# EAGLE design laser (EAGLE 9.6.2)
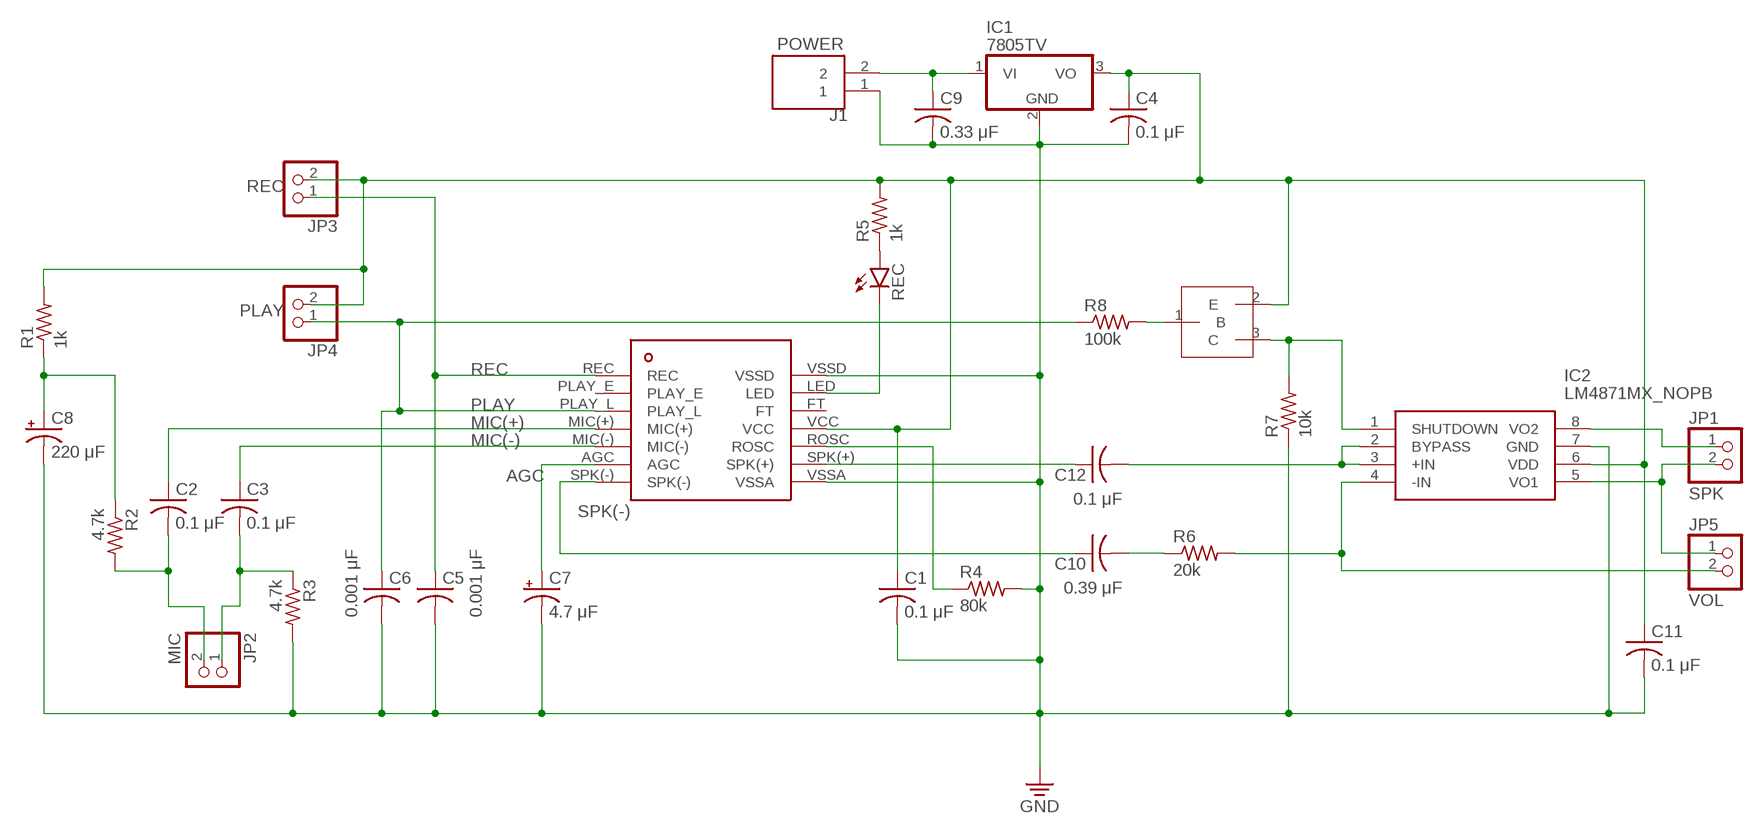
[diagram p0: schematic, sheet 1]

## Parts
C1  0.1 μF  C-USC0805  [C0805]
C2  0.1 μF  C-USC0805  [C0805]
C3  0.1 μF  C-USC0805  [C0805]
C4  0.1 μF  C-USC0805  [C0805]
C5  0.001 μF  C-USC0805  [C0805]
C6  0.001 μF  C-USC0805  [C0805]
C7  4.7 μF  C-POL-US_RADIAL-11MM-DIA  [CAPPRD508W65D1000H1100B]
C8  220 μF  C-POL-US_RADIAL-11MM-DIA  [CAPPRD508W65D1000H1100B]
C9  0.33 μF  C-USC0805  [C0805]
C10  0.39 μF  C-USC0805  [C0805]
C11  0.1 μF  C-USC0805  [C0805]
C12  0.1 μF  C-USC0805  [C0805]
IC1  7805TV  [TO220V]
IC2  LM4871MX_NOPB  [SOIC127P600X175-8N]
J1  POWER  TB004-508-02BE  [CUI_TB004-508-02BE]
JP1  SPK  PINHD-1X2  [1X02]
JP2  MIC  PINHD-1X2  [1X02]
JP3  REC  PINHD-1X2  [1X02]
JP4  PLAY  PINHD-1X2  [1X02]
JP5  VOL  PINHD-1X2  [1X02]
R1  1k  R-US_R0805  [R0805]
R2  4.7k  R-US_R0805  [R0805]
R3  4.7k  R-US_R0805  [R0805]
R4  80k  R-US_R0805  [R0805]
R5  1k  R-US_R0805  [R0805]
R6  20k  R-US_R0805  [R0805]
R7  10k  R-US_R0805  [R0805]
R8  100k  R-US_R0805  [R0805]
REC  LEDCHIP-LED0805  [CHIP-LED0805]
U$1  ISD1820PY  [ISD1820PY]
U$2  2PB709ARL,235  [SOT95P230X110-3N]

## Nets
+5V: C1.1 C4.1 C11.1 IC1.3(VO) IC2.6(VDD) JP3.2 JP4.2 R1.2 R5.2 U$1.VCC U$2.2(E)
AGC: C7.1(+) U$1.AGC
COLLECTOR: IC2.1(SHUTDOWN) R7.2 U$2.3(C)
GND: C1.2 C4.2 C5.2 C6.2 C7.2(-) C8.2(-) C9.2 C11.2 IC1.2(GND) IC2.7(GND) J1.1 R3.2 R4.2 R7.1 U$1.VSSA U$1.VSSD
MIC(+): C2.1 U$1.MIC(+)
MIC(-): C3.1 U$1.MIC(-)
N$1: IC2.8(VO2) JP1.1
N$2: IC2.5(VO1) JP1.2 JP5.1
N$3: R8.2 U$2.1(B)
N$4: IC2.4(-IN) JP5.2 R6.2
N$5: R4.1 U$1.ROSC
N$7: C10.2 R6.1
N$8: C9.1 IC1.1(VI) J1.2
N$9: C12.2 IC2.2(BYPASS) IC2.3(+IN)
N$10: C12.1 U$1.SPK(+)
N$11: C3.2 JP2.1 R3.1
N$12: C2.2 JP2.2 R2.2
N$13: C8.1(+) R1.1 R2.1
N$15: R5.1 REC.A
N$17: REC.C U$1.LED
PLAY: C6.1 JP4.1 R8.1 U$1.PLAY_L
REC: C5.1 JP3.1 U$1.REC
SPK(-): C10.1 U$1.SPK(-)
Unconnected: U$1.FT U$1.PLAY_E

## Library data of the parts
C1-C6 C9-C12 = rcl:C-US: CAPACITOR, American symbol; SPICEPREFIX: C
C7 C8 = Capacitor:C-POL-US: Capacitor Polarised - ANSI; CATEGORY: Capacitor
IC1 = linear:78*: Positive VOLTAGE REGULATOR Source: http://cache.national.com/ds/LM/LM78L05.pdf http://www.fairchildsemi.com/ds/LM/LM7805.pdf
IC2 = LM4871MX_NOPB:LM4871MX_NOPB: Boomer Series: 3W Audio Amplifier with Shutdown Mode Source: Datasheet <http://www.ti.com/lit/gpn/LM4871>; DESCRIPTION: Boomer Series: 3W Audio Amplifier with Shutdown Mode; HEIGHT: 1.75mm; MANUFACTURER_NAME: Texas Instruments; MANUFACTURER_PART_NUMBER: LM4871MX/NOPB; MOUSER_PART_NUMBER: 926-LM4871MX/NOPB; MOUSER_PRICE-STOCK: https://www.mouser.co.uk/ProductDetail/Texas-Instruments/LM4871MX-NOPB?qs=QbsRYf82W3EZ79z1jrjgtA%3D%3D
J1 = TB004-508-02BE:TB004-508-02BE: Screw Terminal 5.08 pitch Check availability <https://pricing.snapeda.com/parts/TB004-508-02BE/CUI%20Devices/view-part?ref=eda>; AVAILABILITY: In Stock; CUI_PURCHASE_URL: https://www.cuidevices.com/product/interconnect/connectors/terminal-blocks/tb004-508-series?utm_source=snapeda.com&utm_medium=referral&utm_campaign=snapedaBOM; DESCRIPTION: 2~24 Poles, Screw Type, Horizontal, 5.08 Pitch, 24~12 (AWG), Terminal Block Connector; MF: CUI Devices; MP: TB004-508-02BE; PACKAGE: None; PRICE: None; PURCHASE-URL: https://pricing.snapeda.com/search/part/TB004-508-02BE/?ref=eda
JP1-JP5 = pinhead:PINHD-1X2: PIN HEADER
R1-R8 = rcl:R-US_: RESISTOR, American symbol; SPICEPREFIX: R
REC = led:LED: LED OSRAM: - CHIPLED LG R971, LG N971, LY N971, LG Q971, LY Q971, LO R971, LY R971 LH N974, LH R974 LS Q976, LO Q976, LY Q976 LO Q996 - Hyper CHIPLED LW Q18S LB Q993, LB Q99A, LB R99A - SideLED LS A670, LO A670, LY A670, LG A670, LP A670 LB A673, LV A673, LT A673, LW A673 LH A674 LY A675 LS A676, LA A676, LO A676, LY A676, LW A676 LS A679, LY A679, LG A679 - Hyper Micro SIDELED® LS Y876, LA Y876, LO Y876, LY Y876 LT Y87S - SmartLED LW L88C, LW L88S LB L89C, LB L89S, LG L890 LS L89K, LO L89K, LY L89K LS L896, LA L896, LO L896, LY L896 - TOPLED LS T670, LO T670, LY T670, LG T670, LP T670 LSG T670, LSP T670, LSY T670, LOP T670, LYG T670 LG T671, LOG T671, LSG T671 LB T673, LV T673, LT T673, LW T673 LH T674 LS T676, LA T676, LO T676, LY T676, LB T676, LH T676, LSB T676, LW T676 LB T67C, LV T67C, LT T67C, LS T67K, LO T67K, LY T67K, LW E67C LS E67B, LA E67B, LO E67B, LY E67B, LB E67C, LV E67C, LT E67C LW T67C LS T679, LY T679, LG T679 LS T770, LO T770, LY T770, LG T770, LP T770 LB T773, LV T773, LT T773, LW T773 LH T774 LS E675, LA E675, LY E675, LS T675 LS T776, LA T776, LO T776, LY T776, LB T776 LHGB T686 LT T68C, LB T68C - Hyper Mini TOPLED® LB M676 - Mini TOPLED Santana® LG M470 LS M47K, LO M47K, LY M47K Source: http://www.osram.convergy.de LUXEON: - LUMILED® LXK2-PW12-R00, LXK2-PW12-S00, LXK2-PW14-U00, LXK2-PW14-V00 LXK2-PM12-R00, LXK2-PM12-S00, LXK2-PM14-U00 LXK2-PE12-Q00, LXK2-PE12-R00, LXK2-PE12-S00, LXK2-PE14-T00, LXK2-PE14-U00 LXK2-PB12-K00, LXK2-PB12-L00, LXK2-PB12-M00, LXK2-PB14-N00, LXK2-PB14-P00, LXK2-PB14-Q00 LXK2-PR12-L00, LXK2-PR12-M00, LXK2-PR14-Q00, LXK2-PR14-R00 LXK2-PD12-Q00, LXK2-PD12-R00, LXK2-PD12-S00 LXK2-PH12-R00, LXK2-PH12-S00 LXK2-PL12-P00, LXK2-PL12-Q00, LXK2-PL12-R00 Source: www.luxeon.com KINGBRIGHT: KA-3528ASYC Source: www.kingbright.com
U$1 = isd1820py:ISD1820PY
U$2 = 2PB709ARL,235-SOT23:2PB709ARL,235

## Board
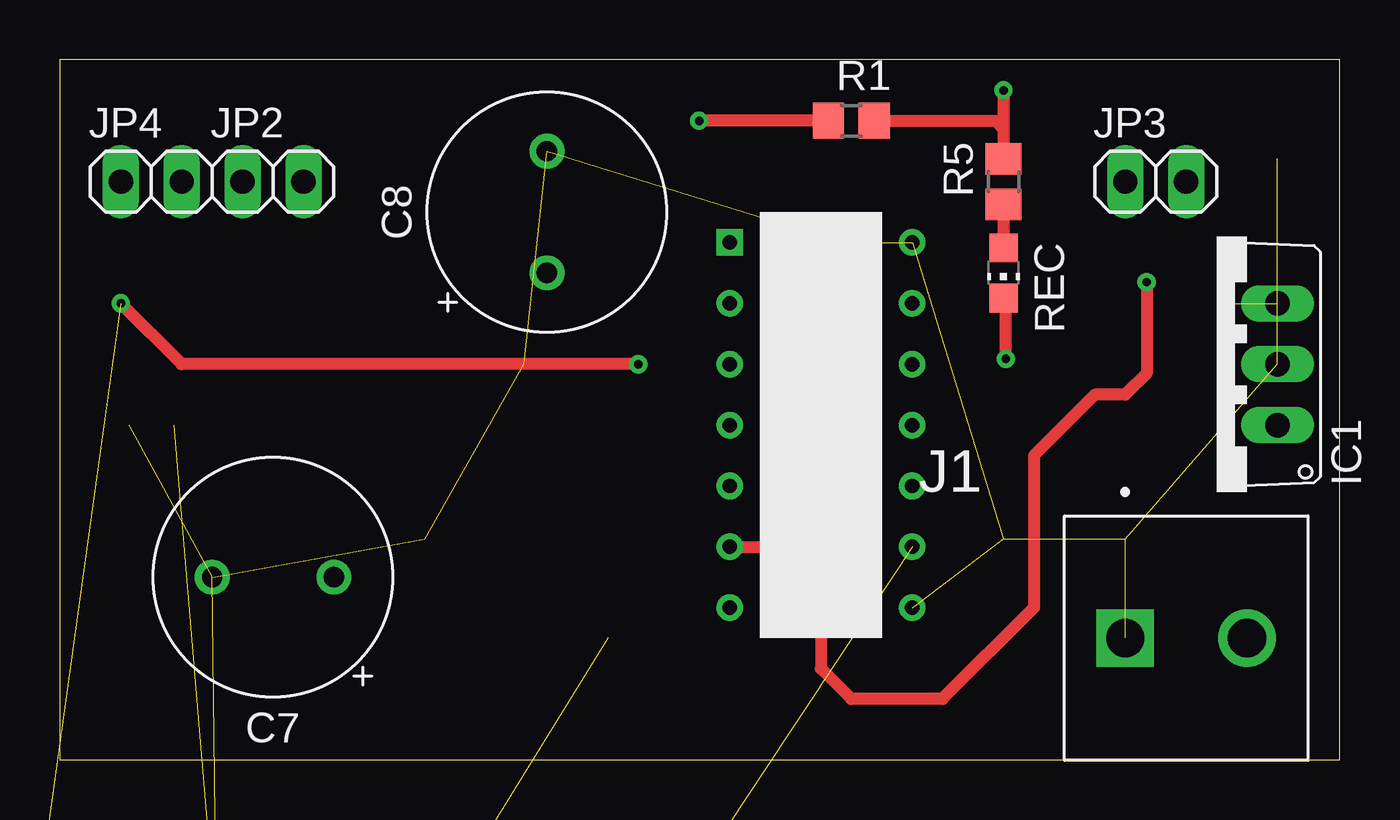
[diagram p1: board, top side]
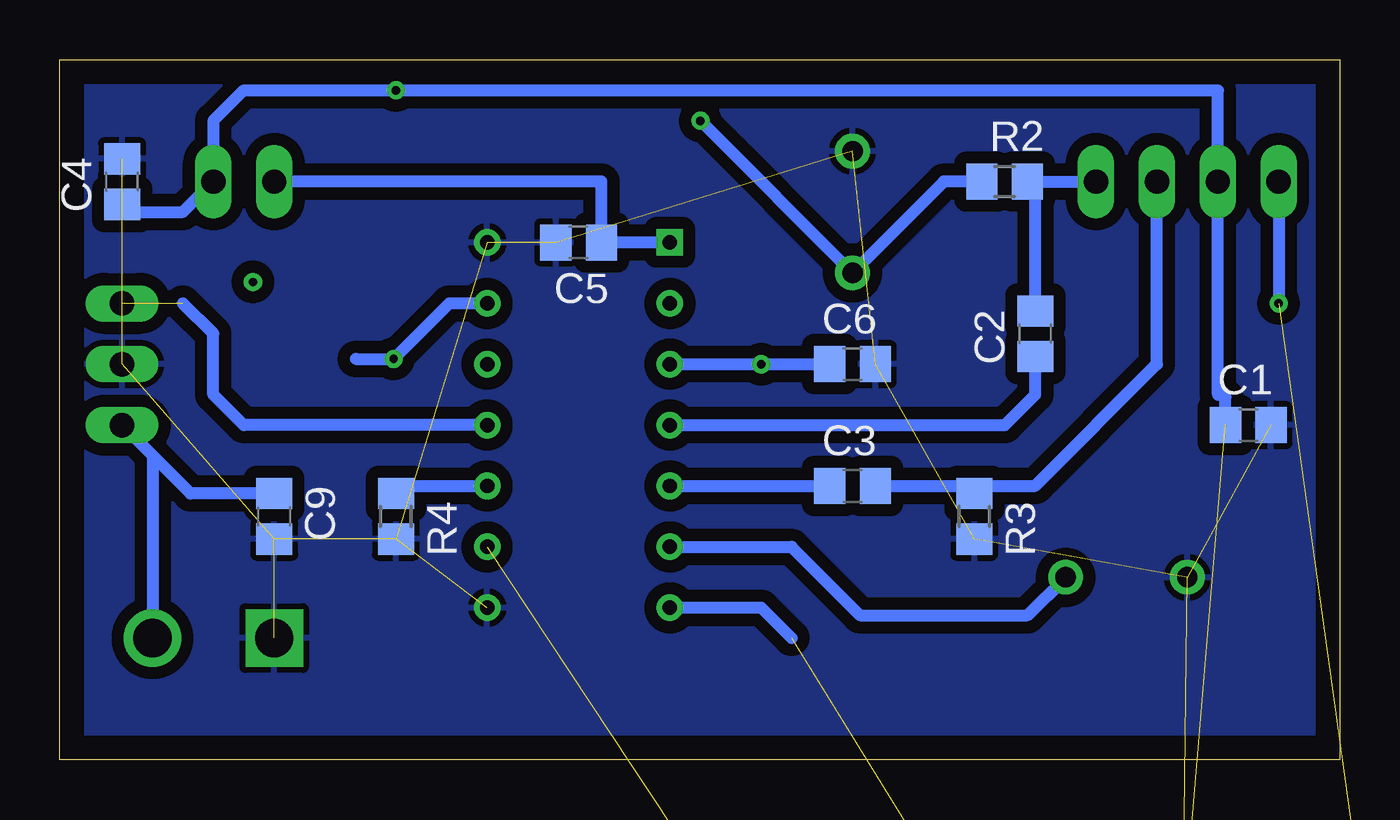
[diagram p2: board, bottom side, seen from below]

Size 53.39 x 29.21 mm. Coordinates in mm from the lower left corner, seen from the top.
Outline: 0,0 53.39,0 53.39,29.21 0,29.21 0,0
Copper layers (1*16): Top 0.035mm / dielectric 1.5mm / Bottom 0.035mm
Design rules "default": minimum track width 6mil, minimum drill 0.35mm, track to track 6mil, track to pad 6mil, pad to pad 6mil, via to via 6mil, smd to smd 6mil, copper to edge 40mil, drill to drill 6mil, minimum pad ring 10mil, minimum via ring 8mil, stop-mask expansion 4mil, vias tented up to drill 0mil, thermal gap 10mil

### Footprints (pad centres in the part's own frame; a part is rotated, then mirrored left to right if it is on the bottom)
C0805 = smd 1.3 x 1.5: 1 -0.95,0; 2 0.95,0
CAPPRD508W65D1000H1100B = drill 0.85 pad 1.45: 1 -2.54,0; 2 2.54,0
TO220V = drill 1.016 long: 1 -2.54,-2.54; 2 0,-2.54; 3 2.54,-2.54
SOIC127P600X175-8N = smd 1.528 x 0.65: 1 -2.711,1.905; 2 -2.711,0.635; 3 -2.711,-0.635; 4 -2.711,-1.905; 5 2.711,-1.905; 6 2.711,-0.635; 7 2.711,0.635; 8 2.711,1.905
CUI_TB004-508-02BE = drill 1.6 square: 1 0,0 | drill 1.6: 2 5.08,0
1X02 = drill 1.016 long: 1 -1.27,0; 2 1.27,0
R0805 = smd 1.3 x 1.5: 1 -0.95,0; 2 0.95,0
CHIP-LED0805 = smd 1.2 x 1.2: A 0,-1.05; C 0,1.05
ISD1820PY = drill 0.6: AGC -3.81,-5.08; FT 3.81,2.54; LED 3.81,5.08; MIC(+) -3.81,0; MIC(-) -3.81,-2.54; PLAY_E -3.81,5.08; PLAY_L -3.81,2.54; ROSC 3.81,-2.54; SPK(+) 3.81,-5.08; SPK(-) -3.81,-7.62; VCC 3.81,0; VSSA 3.81,-7.62; VSSD 3.81,7.62 | drill 0.6 square: REC -3.81,7.62
SOT95P230X110-3N = smd 1.26 x 0.59: 1 -0.98,0.95; 2 -0.98,-0.95; 3 0.98,0

### Placement (x,y rotation side)
C1  3.81,13.97 0 bottom
C2  12.7,17.78 90 bottom
C3  20.32,11.43 0 bottom
C4  50.8,24.13 90 bottom
C5  31.75,21.59 180 bottom
C6  20.32,16.51 0 bottom
C7  8.89,7.62 180 top
C8  20.32,22.86 90 top
C9  44.45,10.16 270 bottom
C10  -1.27,-35.56 0 top  (outside the outline)
C11  -1.27,-41.91 0 top  (outside the outline)
C12  -1.27,-48.26 0 top  (outside the outline)
IC1  48.26,16.51 90 top
IC2  3.81,-6.35 0 top  (outside the outline)
J1  44.45,5.08 0 top
JP1  0,-13.97 0 top  (outside the outline)
JP2  8.89,24.13 0 top
JP3  45.72,24.13 0 top
JP4  3.81,24.13 0 top
JP5  0,-21.59 0 top  (outside the outline)
R1  33.02,26.67 0 top
R2  13.97,24.13 0 bottom
R3  15.24,10.16 270 bottom
R4  39.37,10.16 270 bottom
R5  39.37,24.13 90 top
R6  -1.27,-29.21 0 top  (outside the outline)
R7  -1.27,-54.61 0 top  (outside the outline)
R8  -7.62,-60.96 0 top  (outside the outline)
REC  39.37,20.32 180 top
U$1  31.75,13.97 0 top
U$2  -7.62,-53.34 0 top  (outside the outline)

### Tracks (layer width: path | path; a pad name or v marks a point on that pad's centre or on a via)
+5V  (via drill 0.35)  (6 unrouted)
  Top 0.508: R1.2 39.05,26.67 39.37,26.35 R5.2 v39.37,27.94
  Bottom 0.508: C1.1 4.76,15.14 5.08,15.24 JP4.2 5.08,27.94 v39.37,27.94 45.72,27.94 46.99,26.67 JP3.2 48.26,22.86 50.8,22.86 | 48.26,19.05 46.99,17.78 46.99,15.24 45.72,13.97 U$1.VCC
AGC  (via drill 0.35)
  Top 0.508: U$1.AGC 30.48,8.89 31.75,7.62 31.75,3.81 33.02,2.54 36.83,2.54 40.64,6.35 40.64,12.7 43.18,15.24 44.45,15.24 45.34,16.13 v45.34,19.94
  Bottom 0.508: C7.1 13.02,6.03 20,6.03 22.86,8.89 U$1.AGC | v45.34,19.94 45.3,20
COLLECTOR  (2 unrouted)
GND  (15 unrouted)
  pour Bottom (isolate 0.508): 0,0 0,29.21 53.34,29.21 53.34,0
MIC(+)
  Bottom 0.508: U$1.MIC(+) 13.97,13.97 12.7,15.24 C2.1
MIC(-)
  Bottom 0.508: U$1.MIC(-) C3.1
N$1  (1 unrouted)
N$2  (2 unrouted)
N$3  (1 unrouted)
N$4  (2 unrouted)
N$5
  Bottom 0.508: R4.1 39.76,11.43 U$1.ROSC
N$7  (1 unrouted)
N$8
  Bottom 0.508: J1.2 49.53,12.7 IC1.1 47.94,11.11 C9.1
N$9  (2 unrouted)
N$10  (1 unrouted)
N$11
  Bottom 0.508: C3.2 15.56,11.43 R3.1 14.92,11.43 12.7,11.43 7.62,16.51 JP2.1
N$12
  Bottom 0.508: JP2.2 R2.2 12.7,23.81 C2.2
N$13  (via drill 0.35)
  Top 0.508: R1.1 v26.67,26.67
  Bottom 0.508: v26.67,26.67 C8.1 16.51,24.13 R2.1
N$15
  Top 0.508: R5.1 REC.A
N$17  (via drill 0.35)
  Top 0.508: 39.15,19.05 REC.C 39.47,19.17 v39.47,16.73
  Bottom 0.508: U$1.LED 37.15,19.05 v39.47,16.73 41.05,16.73
PLAY  (via drill 0.35)  (1 unrouted)
  Top 0.508: v24.13,16.51 5.08,16.51 v2.54,19.05
  Bottom 0.508: U$1.PLAY_L v24.13,16.51 C6.1 | JP4.1 v2.54,19.05
REC
  Bottom 0.508: U$1.REC C5.1 30.8,24.13 JP3.1
SPK(-)  (1 unrouted)
  Bottom 0.508: 22.86,5.08 24.13,6.35 U$1.SPK(-)